# EAGLE design Carte compléte (EAGLE 7.6.0)
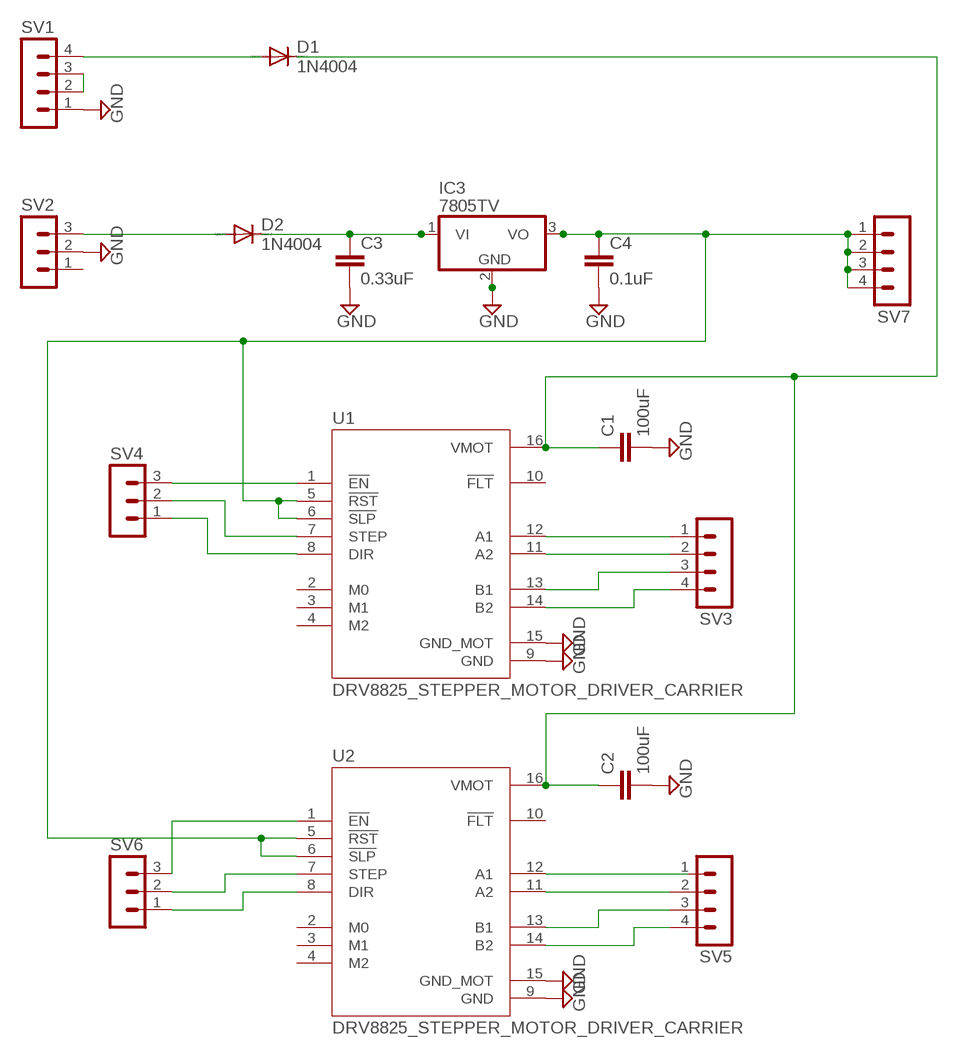
[diagram p0: schematic, sheet 1]

## Parts
C1  100uF  C-EU025-024X044  [C025-024X044]
C2  100uF  C-EU025-024X044  [C025-024X044]
C3  0.33uF  C-EU025-024X044  [C025-024X044]
C4  0.1uF  C-EU025-024X044  [C025-024X044]
D1  1N4004  [DO41-10]
D2  1N4004  [DO41-10]
IC3  7805TV  [TO220V]
SV1  MA04-1  [MA04-1]
SV2  MA03-1  [MA03-1]
SV3  MA04-1  [MA04-1]
SV4  MA03-1  [MA03-1]
SV5  MA04-1  [MA04-1]
SV6  MA03-1  [MA03-1]
SV7  MA04-1  [MA04-1]
U1  DRV8825_STEPPER_MOTOR_DRIVER_CARRIER  [IC_DRV8825_STEPPER_MOTOR_DRIVER_CARRIER]
U2  DRV8825_STEPPER_MOTOR_DRIVER_CARRIER  [IC_DRV8825_STEPPER_MOTOR_DRIVER_CARRIER]

## Nets
GND: C1.2 C2.2 C3.2 C4.2 IC3.2(GND) SV1.1 SV2.2 U1.9(GND) U1.15(GND_MOT) U2.9(GND) U2.15(GND_MOT)
N$1: C3.1 D2.C IC3.1(VI)
N$2: SV4.2 U1.7(STEP)
N$3: C4.1 IC3.3(VO) SV7.1 SV7.2 SV7.3 SV7.4 U1.5(!RST) U1.6(!SLP) U2.5(!RST) U2.6(!SLP)
N$4: D1.A SV1.4
N$5: SV1.2 SV1.3
N$6: D2.A SV2.3
N$7: SV4.3 U1.1(!EN)
N$8: SV3.1 U1.12(A1)
N$9: SV3.2 U1.11(A2)
N$10: SV3.3 U1.13(B1)
N$11: SV3.4 U1.14(B2)
N$12: C1.1 C2.1 D1.C U1.16(VMOT) U2.16(VMOT)
N$13: SV4.1 U1.8(DIR)
N$15: U2.12(A1)
N$16: SV5.2 U2.11(A2)
N$17: SV5.3 U2.13(B1)
N$18: SV5.4 U2.14(B2)
N$19: SV6.3 U2.1(!EN)
N$20: SV6.2 U2.7(STEP)
N$21: SV6.1 U2.8(DIR)
Unconnected: SV2.1 SV5.1 U1.2(M0) U1.3(M1) U1.4(M2) U1.10(!FLT) U2.2(M0) U2.3(M1) U2.4(M2) U2.10(!FLT)

## Library data of the parts
C1-C4 = rcl:C-EU: CAPACITOR, European symbol
D1 D2 = diode:1N4004: DIODE general purpose rectifier, 1 A
IC3 = linear:78*: Positive VOLTAGE REGULATOR Source: http://cache.national.com/ds/LM/LM78L05.pdf http://www.fairchildsemi.com/ds/LM/LM7805.pdf
SV1 SV3 SV5 SV7 = con-lstb:MA04-1: PIN HEADER; OC_FARNELL: unknown; OC_NEWARK: unknown
SV2 SV4 SV6 = con-lstb:MA03-1: PIN HEADER; OC_FARNELL: unknown; OC_NEWARK: unknown
U1 U2 = DRV8825_STEPPER_MOTOR_DRIVER_CARRIER:DRV8825_STEPPER_MOTOR_DRIVER_CARRIER: Stepper motor controler; IC: DRV8825; 1.5A; Uin mot: 8.2÷45V; AVAILABILITY: Unavailable; DESCRIPTION: DRV8825 Motor Controller/Driver Power Management Evaluation Board; MF: Pololu; MP: DRV8825 STEPPER MOTOR DRIVER CARRIER; PACKAGE: None; PRICE: None

## Board
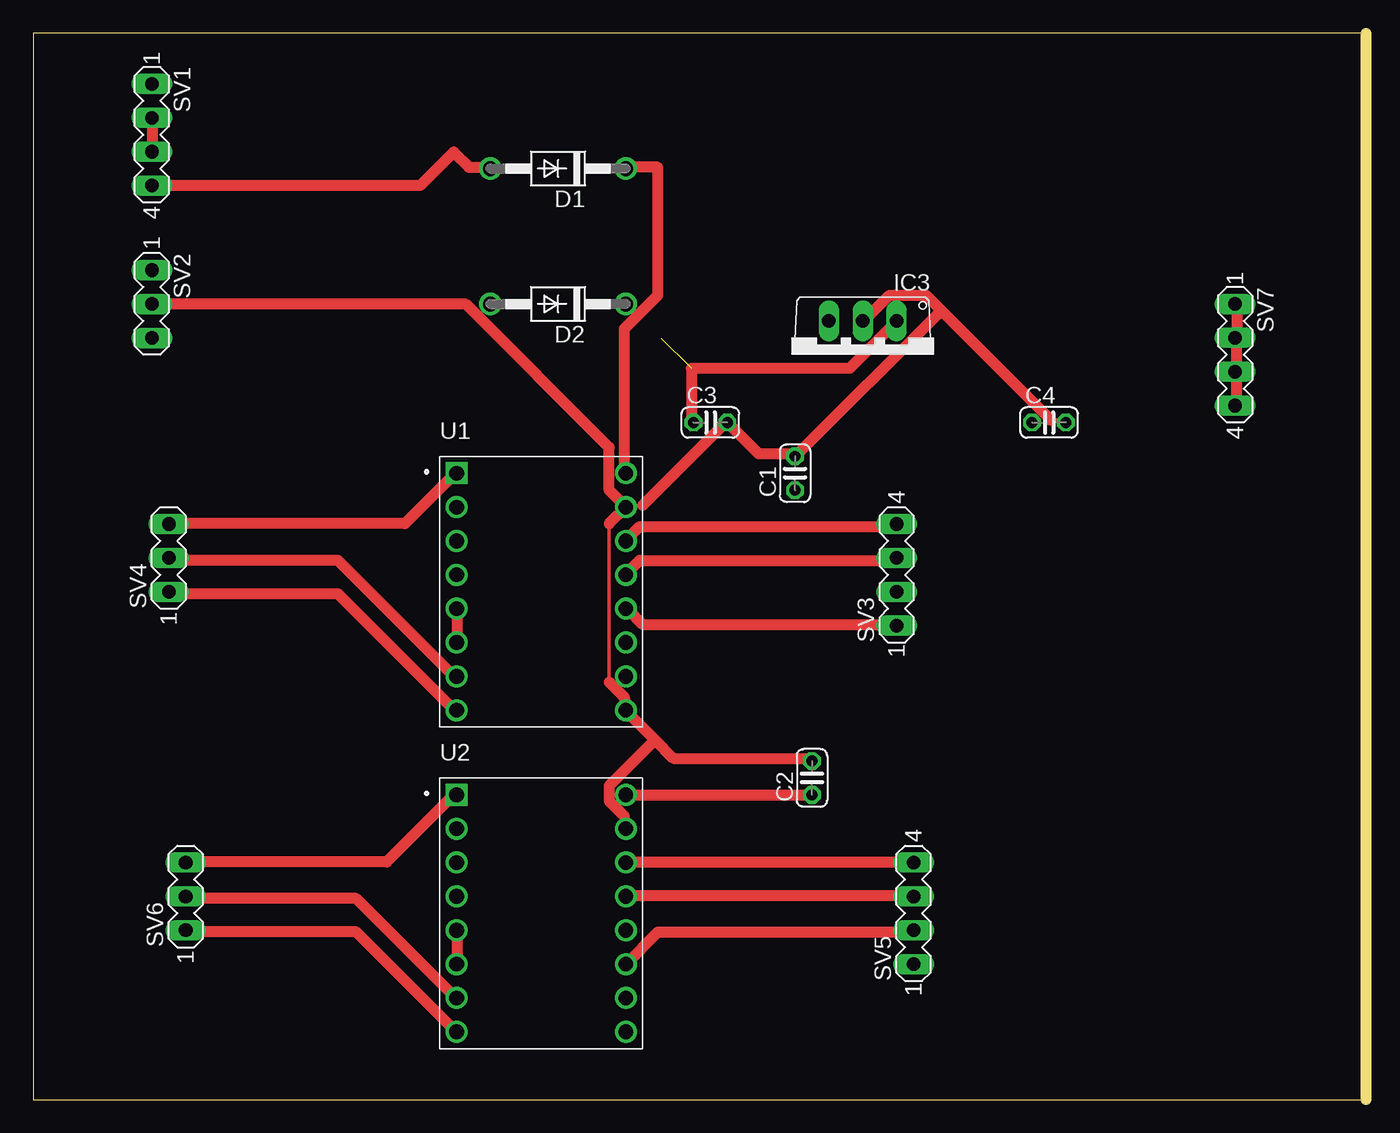
[diagram p1: board, top side]
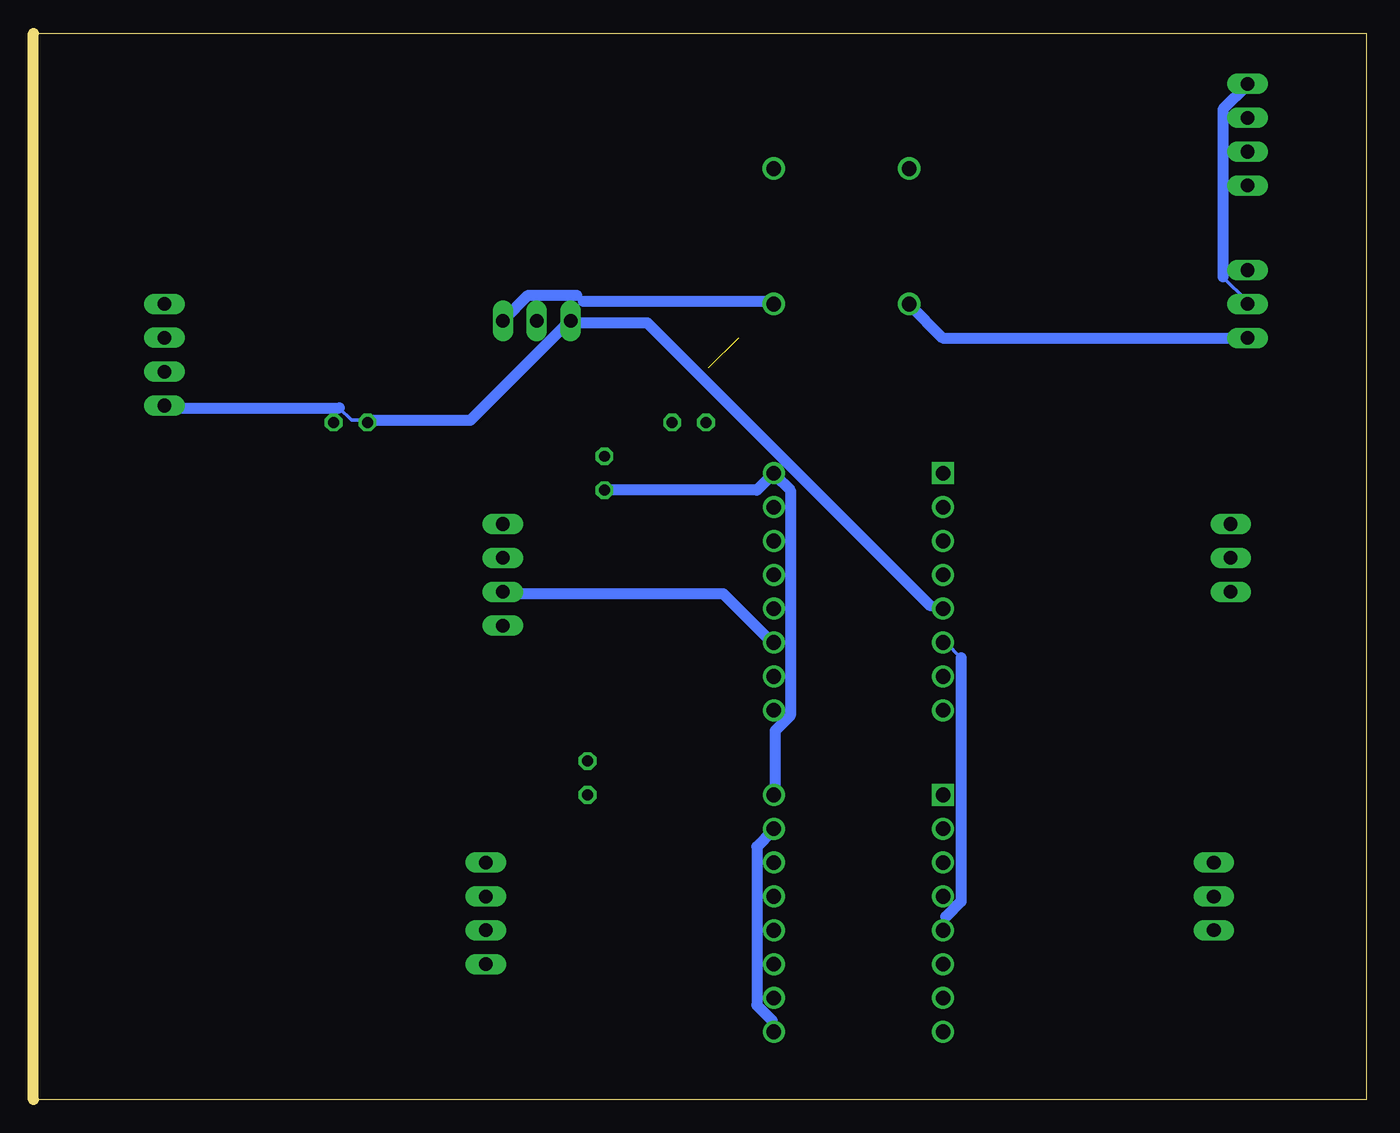
[diagram p2: board, bottom side, seen from below]

Size 100 x 80 mm. Coordinates in mm from the lower left corner, seen from the top.
Outline: 0,0 100,0 100,80 0,80 0,0
Copper layers (1*16): Top 0.035mm / dielectric 1.5mm / Bottom 0.035mm
Design rules "default": minimum track width 10mil, minimum drill 24mil, track to track 8mil, track to pad 8mil, pad to pad 8mil, via to via 8mil, smd to smd 8mil, copper to edge 40mil, drill to drill 8mil, minimum pad ring 10mil, minimum via ring 8mil, stop-mask expansion 4mil, vias tented up to drill 0mil, thermal gap 10mil

### Footprints (pad centres in the part's own frame; a part is rotated, then mirrored left to right if it is on the bottom)
C025-024X044 = drill 0.813 octagon: 1 -1.27,0; 2 1.27,0
DO41-10 = drill 1.118: A 5.08,0; C -5.08,0
TO220V = drill 1.016 long: 1 -2.54,-2.54; 2 0,-2.54; 3 2.54,-2.54
MA04-1 = drill 1.016 long: 1 -3.81,0; 2 -1.27,0; 3 1.27,0; 4 3.81,0
MA03-1 = drill 1.016 long: 1 -2.54,0; 2 0,0; 3 2.54,0
IC_DRV8825_STEPPER_MOTOR_DRIVER_CARRIER = drill 1.1 square: 1 -6.35,8.89 | drill 1.1: 2 -6.35,6.35; 3 -6.35,3.81; 4 -6.35,1.27; 5 -6.35,-1.27; 6 -6.35,-3.81; 7 -6.35,-6.35; 8 -6.35,-8.89; 9 6.35,-8.89; 10 6.35,-6.35; 11 6.35,-3.81; 12 6.35,-1.27; 13 6.35,1.27; 14 6.35,3.81; 15 6.35,6.35; 16 6.35,8.89

### Placement (x,y rotation side)
C1  57.15,46.99 90 top
C2  58.42,24.13 90 top
C3  50.8,50.8 0 top
C4  76.2,50.8 0 top
D1  39.37,69.85 180 top
D2  39.37,59.69 180 top
IC3  62.23,55.88 180 top
SV1  8.89,72.39 270 top
SV2  8.89,59.69 270 top
SV3  64.77,39.37 90 top
SV4  10.16,40.64 90 top
SV5  66.04,13.97 90 top
SV6  11.43,15.24 90 top
SV7  90.17,55.88 270 top
U1  38.1,38.1 0 top
U2  38.1,13.97 0 top

### Tracks (layer width: path | path; a pad name or v marks a point on that pad's centre or on a via)
GND
  Top 0.254: 58.29,25.6 C2.2 | 44.35,21.26 44.35,20.34 U2.15 | 76.35,50.98 77.27,50.98 C4.2 | 62.41,58.52 IC3.2 62.18,58.52 | 57.15,48.46 C1.2 57.15,48.23 | 45.72,44.58 44.58,44.58 U1.15 44.35,44.58 | 51.89,50.75 C3.2 | 8.91,59.66 SV2.2 | 43.2,43.2 43.2,31.32 | 44.35,29.26 U1.9
  Top 0.813: 58.29,25.6 48.01,25.6 46.63,26.98 | 46.63,26.98 44.58,29.03 U1.9 | 44.35,21.26 43.2,22.4 43.2,23.55 46.63,26.98 | 68.12,59.21 66.98,60.35 64.24,60.35 62.41,58.52 | 68.12,59.21 76.35,50.98 | 57.15,48.46 54.41,48.46 C3.2 | 51.89,50.75 45.72,44.58 | 8.91,59.66 32.46,59.66 43.2,48.92 43.2,45.72 44.35,44.58 | 57.15,48.23 68.12,59.21 | 44.35,29.26 44.35,30.18 43.2,31.32 | U1.15 43.2,43.2
  Bottom 0.254: 44.58,5.94 44.58,5.26 U2.9 | 44.58,20.12 U2.15 | 10.74,61.72 8.91,59.89 SV2.2 | 8.91,76.12 SV1.1
  Bottom 0.813: 44.58,5.94 45.72,7.09 45.72,18.97 44.58,20.12 | 10.74,61.72 10.74,74.3 8.91,76.12
N$1  (1 unrouted)
  Top 0.254: 64.92,58.52 IC3.1 64.69,58.29 | 49.38,50.98 C3.1
  Top 0.813: 49.38,50.98 49.38,54.86 61.27,54.86 64.69,58.29
  Bottom 0.254: 59.21,60.35 58.75,59.89 | 44.58,59.89 D2.C | 64.69,58.52 IC3.1
  Bottom 0.813: 58.75,59.89 44.58,59.89 | 59.21,60.35 62.87,60.35 64.69,58.52
N$2
  Top 0.254: 10.29,40.46 SV4.2 | 31.55,31.77 U1.7
  Top 0.813: 10.29,40.46 22.86,40.46 31.55,31.77
N$3
  Top 0.254: 31.77,10.29 U2.6 | 31.77,12.57 U2.5 | 31.77,34.29 U1.6 | 31.77,36.8 U1.5 | 90.3,59.66 SV7.1 | 59.66,58.52 IC3.3 | 90.3,54.41 SV7.3 90.3,54.63 | 90.3,52.12 SV7.4 | 90.3,57.15 SV7.2
  Top 0.813: 31.77,12.57 31.77,10.29 | 31.77,36.8 31.77,34.29 | 90.3,59.66 90.3,57.15 90.3,54.63 | 90.3,52.12 90.3,54.41
  Bottom 0.254: 31.55,13.72 31.55,12.8 U2.5 | 30.4,33.15 31.55,34.29 U1.6 | 77.04,51.89 76.12,50.98 74.98,50.98 C4.1 74.75,50.98 | 90.07,51.89 SV7.4 | 59.89,58.29 IC3.3 59.66,58.29 | 32.69,37.03 31.77,37.03 U1.5
  Bottom 0.813: 31.55,13.72 30.4,14.86 30.4,33.15 | 90.07,51.89 77.04,51.89 | 59.89,58.29 67.21,50.98 74.75,50.98 | 32.69,37.03 53.95,58.29 59.66,58.29
N$4
  Top 0.254: 34.29,69.95 D1.A
  Top 0.813: SV1.4 29.03,68.58 31.55,71.09 32.69,69.95 34.29,69.95
N$5
  Top 0.254: 8.91,73.61 SV1.2
  Top 0.813: 8.91,73.61 8.91,71.32 SV1.3
N$6
  Bottom 0.254: 34.29,59.66 D2.A
  Bottom 0.813: SV2.3 31.77,57.15 34.29,59.66
N$7
  Top 0.254: 10.29,43.2 SV4.3 | 31.55,46.86 U1.1
  Top 0.813: 10.29,43.2 27.89,43.2 31.55,46.86
N$8
  Top 0.254: 64.69,35.66 SV3.1 | 44.58,36.8 U1.12
  Top 0.813: 64.69,35.66 45.72,35.66 44.58,36.8
N$9
  Bottom 0.254: 64.69,37.95 SV3.2 | 44.58,34.29 U1.11
  Bottom 0.813: 64.69,37.95 48.23,37.95 44.58,34.29
N$10
  Top 0.254: 64.69,40.46 SV3.3 | 44.58,39.55 U1.13
  Top 0.813: 64.69,40.46 45.49,40.46 44.58,39.55
N$11
  Top 0.254: 64.69,42.98 SV3.4 | 44.58,42.06 U1.14
  Top 0.813: 64.69,42.98 45.49,42.98 44.58,42.06
N$12
  Top 0.254: 44.35,47.09 U1.16 | 44.58,69.95 D1.C
  Top 0.813: U2.16 C2.1 | 44.35,47.09 44.35,57.84 46.86,60.35 46.86,69.95 44.58,69.95
  Bottom 0.254: 44.35,22.86 U2.16 | 44.35,46.86 U1.16
  Bottom 0.813: C1.1 45.72,45.72 U1.16 | 44.35,22.86 44.35,27.66 43.2,28.8 43.2,45.72 44.35,46.86
N$13
  Top 0.254: 10.29,37.95 SV4.1 | 31.55,29.26 U1.8
  Top 0.813: 10.29,37.95 22.86,37.95 31.55,29.26
N$16
  Top 0.254: 65.84,12.57 SV5.2
  Top 0.813: 65.84,12.57 46.86,12.57 U2.11
N$17
  Top 0.254: 65.84,15.32 SV5.3 | 44.58,15.32 U2.13
  Top 0.813: 44.58,15.32 65.84,15.32
N$18
  Top 0.254: 65.84,17.83 SV5.4 | 44.58,17.83 U2.14
  Top 0.813: 44.58,17.83 65.84,17.83
N$19
  Top 0.254: 11.43,17.83 SV6.3 | 31.55,22.86 U2.1
  Top 0.813: 11.43,17.83 26.52,17.83 31.55,22.86
N$20
  Top 0.254: 11.43,15.09 SV6.2 | 31.55,7.77 U2.7
  Top 0.813: 11.43,15.09 24.23,15.09 31.55,7.77
N$21
  Top 0.254: 11.43,12.57 SV6.1 | 31.55,5.26 U2.8
  Top 0.813: 11.43,12.57 24.23,12.57 31.55,5.26